# Altium schematic sheet thrust_RP2040.SchDoc
size 381 x 241 mm; SheetNumber: 1; SheetTotal: 1
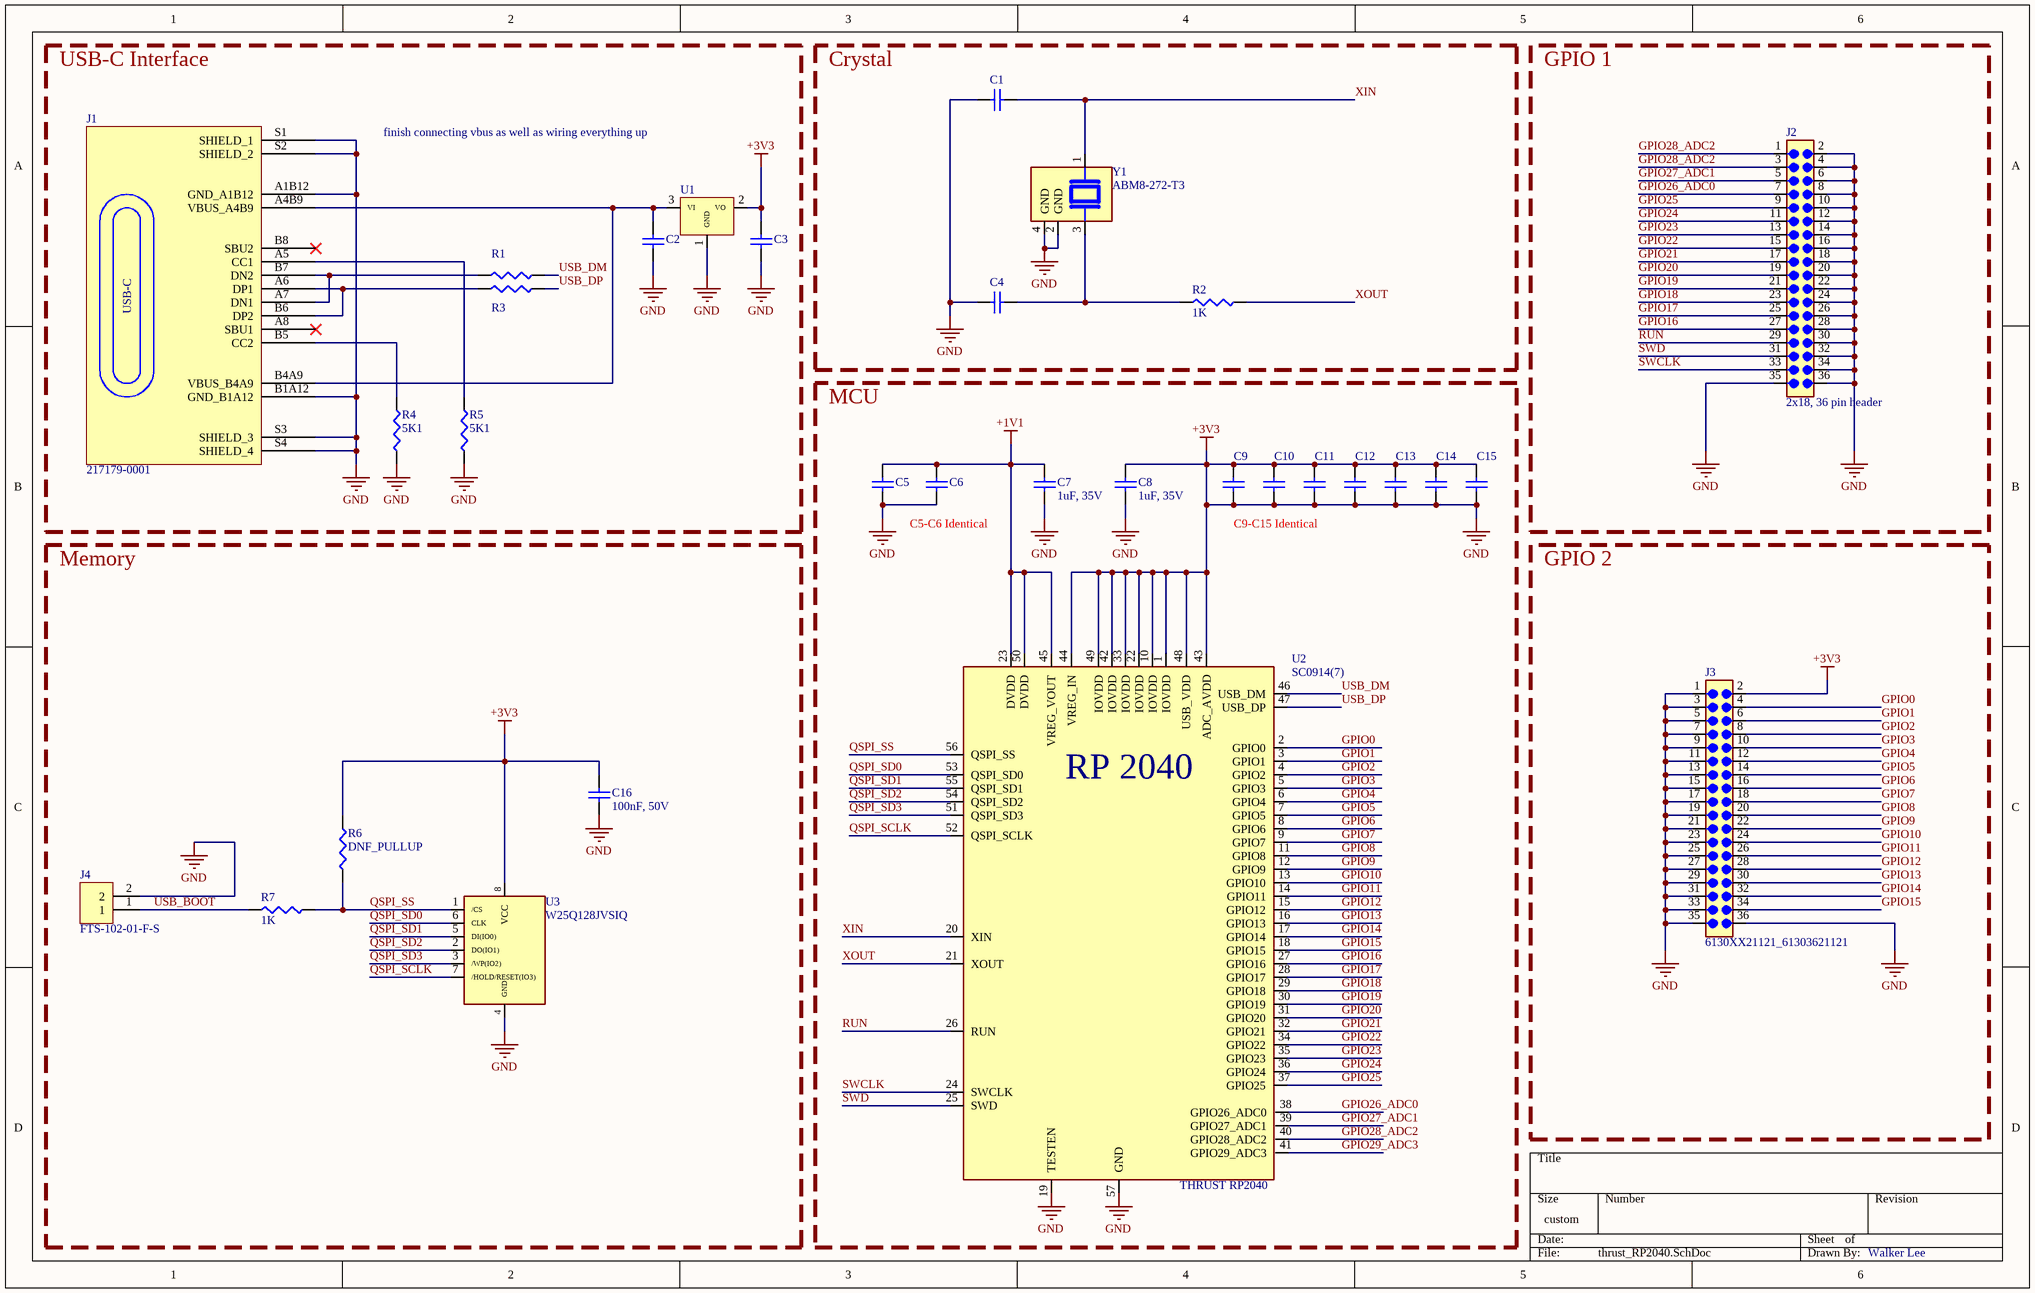
[diagram p0: thrust_RP2040.SchDoc]

## Parts
C1  CL05C150JB5NNNC  (value not drawn)
C2  10uF, 10V  [CAPC1005X55N]  (value not drawn)
C3  10uF, 10V  [CAPC1005X55N]  (value not drawn)
C4  CL05C150JB5NNNC  (value not drawn)
C5  100nF, 50V  [CAPC1005X55N]  (value not drawn)
C6  100nF, 50V  [CAPC1005X55N]  (value not drawn)
C7  1uF, 35V  [CAPC1005X55N]
C8  1uF, 35V  [CAPC1005X55N]
C9  100nF, 50V  [CAPC1005X55N]  (value not drawn)
C10  100nF, 50V  [CAPC1005X55N]  (value not drawn)
C11  100nF, 50V  [CAPC1005X55N]  (value not drawn)
C12  100nF, 50V  [CAPC1005X55N]  (value not drawn)
C13  100nF, 50V  [CAPC1005X55N]  (value not drawn)
C14  100nF, 50V  [CAPC1005X55N]  (value not drawn)
C15  100nF, 50V  [CAPC1005X55N]  (value not drawn)
C16  100nF, 50V  [CAPC1005X55N]
J1  217179-0001  [FP-2171790001-MFG]
J2  2x18, 36 pin header  [61303621121]
J3  6130XX21121_61303621121  [61303621121]
J4  FTS-102-01-F-S
R1  27R  [RESC1005X37N]  (value not drawn)
R2  1K  [RESC1005X37N]
R3  27R  [RESC1005X37N]  (value not drawn)
R4  5K1  [RESC1005X37N]
R5  5K1  [RESC1005X37N]
R6  DNF_PULLUP  [RESC1005X37N]  (no BOM)
R7  1K  [RESC1005X37N]
U1  NCP1117ST33T3G  (value not drawn)
U2  SC0914(7)
U3  W25Q128JVSIQ  [SOIC127P790X216-8N]
Y1  ABM8-272-T3  [XTAL_ABM8-272-T3]

## Blocks framed on the sheet
USB-C Interface: C2 C3 J1 R1 R3-R5 U1
Crystal: C1 C4 R2 Y1
GPIO 1: J2
MCU: C5-C15 U2
Memory: C16 J4 R6 R7 U3
GPIO 2: J3

## Nets
+1V1: C5.2 C6.2 C7.2 U2.23(DVDD) U2.45(VREG_VOUT) U2.50(DVDD)
+3V3: C1.1 C2.1 C3.1 C3.2 C4.1 C5.1 C6.1 C7.1 C8.1 C8.2 C9.1 C9.2 C10.1 C10.2 C11.1 C11.2 C12.1 C12.2 C13.1 C13.2 C14.1 C14.2 C15.1 C15.2 C16.1 C16.2 J1.A1B12(GND_A1B12) J1.B1A12(GND_B1A12) J1.S1(SHIELD_1) J1.S2(SHIELD_2) J1.S3(SHIELD_3) J1.S4(SHIELD_4) J2.2 J2.4 J2.6 J2.8 J2.10 J2.12 J2.14 J2.16 J2.18 J2.20 J2.22 J2.24 J2.26 J2.28 J2.30 J2.32 J2.34 J2.35 J2.36 J3.1 J3.2 J3.3 J3.5 J3.7 J3.9 J3.11 J3.13 J3.15 J3.17 J3.19 J3.21 J3.23 J3.25 J3.27 J3.29 J3.31 J3.33 J3.35 J3.36 J4.2 R4.1 R5.1 R6.2 U1.1(GND) U1.2(VO) U2.1(IOVDD) U2.10(IOVDD) U2.19(TESTEN) U2.22(IOVDD) U2.33(IOVDD) U2.42(IOVDD) U2.43(ADC_AVDD) U2.44(VREG_IN) U2.48(USB_VDD) U2.49(IOVDD) U2.57(GND) U3.4(GND) U3.8(VCC) Y1.2(GND) Y1.4(GND)  [also labelled GND]
~{USB_BOOT}: J4.1 R7.1
GPIO0: J3.4 U2.2(GPIO0)
GPIO1: J3.6 U2.3(GPIO1)
GPIO2: J3.8 U2.4(GPIO2)
GPIO3: J3.10 U2.5(GPIO3)
GPIO4: J3.12 U2.6(GPIO4)
GPIO5: J3.14 U2.7(GPIO5)
GPIO6: J3.16 U2.8(GPIO6)
GPIO7: J3.18 U2.9(GPIO7)
GPIO8: J3.20 U2.11(GPIO8)
GPIO9: J3.22 U2.12(GPIO9)
GPIO10: J3.24 U2.13(GPIO10)
GPIO11: J3.26 U2.14(GPIO11)
GPIO12: J3.28 U2.15(GPIO12)
GPIO13: J3.30 U2.16(GPIO13)
GPIO14: J3.32 U2.17(GPIO14)
GPIO15: J3.34 U2.18(GPIO15)
GPIO16: J2.27 U2.27(GPIO16)
GPIO17: J2.25 U2.28(GPIO17)
GPIO18: J2.23 U2.29(GPIO18)
GPIO19: J2.21 U2.30(GPIO19)
GPIO20: J2.19 U2.31(GPIO20)
GPIO21: J2.17 U2.32(GPIO21)
GPIO22: J2.15 U2.34(GPIO22)
GPIO23: J2.13 U2.35(GPIO23)
GPIO24: J2.11 U2.36(GPIO24)
GPIO25: J2.9 U2.37(GPIO25)
GPIO26_ADC0: J2.7 U2.38(GPIO26_ADC0)
GPIO27_ADC1: J2.5 U2.39(GPIO27_ADC1)
GPIO28_ADC2: J2.1 J2.3 U2.40(GPIO28_ADC2)
GPIO29_ADC3: U2.41(GPIO29_ADC3)
QSPI_SCLK: U2.52(QSPI_SCLK) U3.7(/HOLD/RESET(IO3))
QSPI_SD0: U2.53(QSPI_SD0) U3.6(CLK)
QSPI_SD1: U2.55(QSPI_SD1) U3.5(DI(IO0))
QSPI_SD2: U2.54(QSPI_SD2) U3.2(DO(IO1))
QSPI_SD3: U2.51(QSPI_SD3) U3.3(/WP(IO2))
QSPI_SS: R6.1 R7.2 U2.56(QSPI_SS) U3.1(/CS)
RUN: J2.29 U2.26(RUN)
SWCLK: J2.33 U2.24(SWCLK)
SWD: J2.31 U2.25(SWD)
USB_DM: R1.2 U2.46(USB_DM)
USB_DP: R3.2 U2.47(USB_DP)
XIN: C1.2 U2.20(XIN) Y1.1
XOUT: R2.2 U2.21(XOUT)
NetC2_2: C2.2 J1.A4B9(VBUS_A4B9) J1.B4A9(VBUS_B4A9) U1.3(VI)
NetC4_2: C4.2 R2.1 Y1.3
NetJ1_A5: J1.A5(CC1) R5.2
NetJ1_A6: J1.A6(DP1) J1.B6(DP2) R3.1
NetJ1_A7: J1.A7(DN1) J1.B7(DN2) R1.1
NetJ1_B5: J1.B5(CC2) R4.2

Not connected (* = marked no-connect by the designer): J1 A8(SBU1)* B8(SBU2)*

## Notes on the sheet
- finish connecting vbus as well as wiring everything up
- C5-C6 Identical
- C9-C15 Identical
- (near U2) THRUST RP2040
- Walker Lee
- (in symbol 217179-0001) USB-C
- (in symbol SC0914(7)) RP 2040

## Library data of the parts
C1 C4 = CL05C150JB5NNNC: CAP CER 15PF 50V C0G/NP0 0402; Manufacturer: Samsung Electro-Mechanics; Dielectric: C0G; Dielectric Material: Ceramic; Temperature Coefficient: 30ppm/°C; Tolerance: 5%; Supplier: DigiKey; Supplier Part Number: 1276-1179-6-ND; Manufacturer Part Number: CL05C150JB5NNNC; RoHS: Compliant; Category: Ceramic Capacitors; Stock: 499533; Pricing: 1=0.1, 10=0.027, 50=0.0176, 100=0.015, 500=0.01054, 1000=0.00917, 2500=0.00775, 5000=0.0069 (USD); Value: 15pF; Case/Package: 0402; Case Code (Imperial): 0402; Case Code (Metric): 1005; China RoHS: Compliant; Contact Plating: Tin; Country of Origin: Mainland China, Philippines, South Korea; Depth: 500µm; Export Control Classification Number (ECCN) Code: EAR99; Height: 550µm; Harmonized Tariff Schedule (HTS) Code: 8532.24.00.20; Introduction Date: 2007-11-14; Length: 1mm; Lifecycle Status: Production; Material: Ceramic; Max Operating Temperature: 125°C; Min Operating Temperature: -55°C; Mounting Technology: Surface Mount; Number of Terminals: 2; Radiation Hardening: No; REACH SVHC: Yes; Schedule B: 8532240020, 8532240020|8532240020, 8532240020|8532240020|8532240020, 8532240020|8532240020|8532240020|8532240020; Thickness: 558.8µm; Voltage: 50V; Voltage Rating: 50V; Voltage Rating (DC): 50V; Width: 500µm; ComponentLink1URL: https://datasheet.octopart.com:443/CL05C150JB5NNNC-Samsung-Electro-Mechanics-datasheet-136482249.pdf?src-supplier=IHS; ComponentLink1Description: https://datasheet.octopart.com:443/CL05C150JB5NNNC-Samsung-Electro-Mechanics-datasheet-136482249.pdf?src-supplier=IHS; ComponentLink2URL: https://datasheet.octopart.com:443/CL05C150JB5NNNC-Samsung-Electro-Mechanics-datasheet-11549173.pdf?src-supplier=Future+Electronics; ComponentLink2Description: https://datasheet.octopart.com:443/CL05C150JB5NNNC-Samsung-Electro-Mechanics-datasheet-11549173.pdf?src-supplier=Future+Electronics; ComponentLink3URL: https://datasheet.octopart.com:443/CL05C150JB5NNNC-Samsung-Electro-Mechanics-datasheet-110326796.pdf?src-supplier=Future+Electronics; ComponentLink3Description: https://datasheet.octopart.com:443/CL05C150JB5NNNC-Samsung-Electro-Mechanics-datasheet-110326796.pdf?src-supplier=Future+Electronics; ComponentLink4URL: https://datasheet.octopart.com:443/CL05C150JB5NNNC-Samsung-Electro-Mechanics-datasheet-81461711.pdf?src-supplier=Future+Electronics; ComponentLink4Description: https://datasheet.octopart.com:443/CL05C150JB5NNNC-Samsung-Electro-Mechanics-datasheet-81461711.pdf?src-supplier=Future+Electronics; ComponentLink5URL: https://datasheet.octopart.com:443/CL05C150JB5NNNC-Samsung-datasheet-12555055.pdf?src-supplier=Future+Electronics; ComponentLink5Description: https://datasheet.octopart.com:443/CL05C150JB5NNNC-Samsung-datasheet-12555055.pdf?src-supplier=Future+Electronics; ComponentLink6URL: https://datasheet.octopart.com:443/CL05C150JB5NNNC-Samsung-Electro-Mechanics-datasheet-149136764.pdf?src-supplier=Future+Electronics; ComponentLink6Description: https://datasheet.octopart.com:443/CL05C150JB5NNNC-Samsung-Electro-Mechanics-datasheet-149136764.pdf?src-supplier=Future+Electronics; ComponentLink7URL: https://datasheet.octopart.com:443/CL05C150JB5NNNC-Samsung-datasheet-37081328.pdf?src-supplier=Future+Electronics; ComponentLink7Description: https://datasheet.octopart.com:443/CL05C150JB5NNNC-Samsung-datasheet-37081328.pdf?src-supplier=Future+Electronics; ComponentLink8URL: https://datasheet.octopart.com/CL05C150JB5NNNC-Samsung-Electro-Mechanics-datasheet-97040617.pdf; ComponentLink8Description: https://datasheet.octopart.com/CL05C150JB5NNNC-Samsung-Electro-Mechanics-datasheet-97040617.pdf; ComponentLink9URL: https://datasheet.octopart.com/CL05C150JB5NNNC-Samsung-Electro-Mechanics-datasheet-8324245.pdf; ComponentLink9Description: https://datasheet.octopart.com/CL05C150JB5NNNC-Samsung-Electro-Mechanics-datasheet-8324245.pdf; ComponentLink10URL: https://datasheet.octopart.com:443/CL05C150JB5NNNC-Samsung-datasheet-8326407.pdf?src-supplier=TME; ComponentLink10Description: https://datasheet.octopart.com:443/CL05C150JB5NNNC-Samsung-datasheet-8326407.pdf?src-supplier=TME; LCSC Part Number: C86285
C2 C3 = CL05A106MP8NUB8: CAP CER 10UF 10V X5R 0402; Manufacturer: Samsung; Dielectric Material: Ceramic; Multilayer: Yes; Tolerance  (fill in as +-): 20%; Supplier: Digikey; Supplier Part Number: 1276-6830-1-ND; Manufacturer Part Number: CL05A106MP8NUB8; RoHS: Yes; Category: Ceramic Capacitors; Stock: 1294909; Pricing: 1=0.33, 10=0.215, 50=0.1584, 100=0.129, 500=0.1018, 1000=0.08597, 2500=0.08145 (USD); Mounting Technology: Surface Mount; Pins: 2; Package Shape: Rectangular; Case/Package: 0402; Terminal Finish: Nickel; Min Operating Temperature: -55°C; Max Operating Temperature: 85°C; JESD-609 Code: e3; Value: 10uF; Capacitor Type: Ceramic; Packaging: Tape and Reel; Tolerance (fill in as +-): 20%; Rated DC Voltage (URdc): 10V; Temperature Characteristics Code: X5R; Termination: Wraparound; Reach SVHC Compliant: Yes; RoHS Compliant: Yes; ComponentLink1URL: https://datasheet.ciiva.com:443/pdfs/VipMasterIC/IC/SEMS/SEMS-S-A0008521219/SEMS-S-A0008521325-1.pdf?src-supplier=IHS+Markit; ComponentLink1Description: https://datasheet.ciiva.com:443/pdfs/VipMasterIC/IC/SEMS/SEMS-S-A0008521219/SEMS-S-A0008521325-1.pdf?src-supplier=IHS+Markit; ComponentLink2URL: http://www.samsungsem.com/kr/support/product-search/mlcc/CL05A106MP8NUB8.jsp?src-supplier=Digikey; ComponentLink2Description: http://www.samsungsem.com/kr/support/product-search/mlcc/CL05A106MP8NUB8.jsp?src-supplier=Digikey; ComponentLink3URL: https://datasheet.octopart.com/CL05A106MP8NUB8-Samsung-Electro-Mechanics-datasheet-136460857.pdf?src-supplier=Future+Electronics; ComponentLink3Description: https://datasheet.octopart.com/CL05A106MP8NUB8-Samsung-Electro-Mechanics-datasheet-136460857.pdf?src-supplier=Future+Electronics; LCSC Part Number: C307415
C5 C6 C9-C16 = CL05B104KB54PNC: 50V 100nF X7R 10% 0402 Multilayer Ceramic Capacitors MLCC - SMD/SMT ROHS; Manufacturer: Samsung; Supplier: Digikey; Supplier Part Number: 1276-CL05B104KB54PNCCT-ND; Manufacturer Part Number: CL05B104KB54PNC; RoHS: Yes; Category: Ceramic Capacitors; Stock: 1237875; Pricing: 1=0.1, 10=0.044, 50=0.025, 100=0.0194, 500=0.0146, 1000=0.01147, 2500=0.01043, 5000=0.00959 (USD); Pins: 2; Dielectric Material: Ceramic; Capacitor Type: Ceramic; RoHS Compliant: Yes; Reach SVHC Compliant: Yes; ComponentLink1URL: https://datasheet.ciiva.com:443/pdfs/VipMasterIC/IC/SEMS/SEMS-S-A0006318249/SEMS-S-A0006320959-1.pdf?src-supplier=IHS+Markit; ComponentLink1Description: https://datasheet.ciiva.com:443/pdfs/VipMasterIC/IC/SEMS/SEMS-S-A0006318249/SEMS-S-A0006320959-1.pdf?src-supplier=IHS+Markit; ComponentLink2URL: https://datasheet.octopart.com/CL05B104KB54PNC-Samsung-datasheet-8326407.pdf?src-supplier=TME; ComponentLink2Description: https://datasheet.octopart.com/CL05B104KB54PNC-Samsung-datasheet-8326407.pdf?src-supplier=TME; LCSC Part Number: C307331; Value: 100nF; Case/Package: 0402; China RoHS: Compliant; Country of Origin: Mainland China, Philippines, South Korea; Export Control Classification Number (ECCN) Code: EAR99; Height: 500µm; Harmonized Tariff Schedule (HTS) Code: 8532.24.00.20; Introduction Date: 2018-07-31; Length: 1mm; Lifecycle Status: Production; Material: Ceramic; Max Operating Temperature: 125°C; Min Operating Temperature: -55°C; Mounting Technology: Surface Mount; Number of Terminals: 2; Ratings: AEC-Q200; REACH SVHC: Yes; Schedule B: 8532240020, 8532240020|8532240020|8532240020|8532240020|8532240020|8532240020|8532240020|8532240020|8532240020|8532240020|8532240020|8532240020|8532240020|8532240020|8532240020|8532240020|8532240020|8532240020|8532240020|8532240020|8532240020|8532240020|8532240020|85; Tolerance: 10%; Voltage Rating: 50V; Voltage Rating (DC): 50V; Width: 500µm; ComponentLink3URL: https://datasheet.octopart.com:443/CL05B104KB54PNC-Samsung-Electro-Mechanics-datasheet-182018727.pdf?src-supplier=IHS; ComponentLink3Description: https://datasheet.octopart.com:443/CL05B104KB54PNC-Samsung-Electro-Mechanics-datasheet-182018727.pdf?src-supplier=IHS; ComponentLink4URL: https://datasheet.octopart.com:443/CL05B104KB54PNC-Samsung-Electro-Mechanics-datasheet-138685816.pdf?src-supplier=Samsung+SCT; ComponentLink4Description: https://datasheet.octopart.com:443/CL05B104KB54PNC-Samsung-Electro-Mechanics-datasheet-138685816.pdf?src-supplier=Samsung+SCT; ComponentLink5URL: https://datasheet.octopart.com:443/CL05B104KB54PNC-Samsung-datasheet-8326407.pdf?src-supplier=TME; ComponentLink5Description: https://datasheet.octopart.com:443/CL05B104KB54PNC-Samsung-datasheet-8326407.pdf?src-supplier=TME
C7 C8 = CL05A105KL5NRNC: CAP CER 1UF 35V X5R 0402; Manufacturer: Samsung; Dielectric Material: Ceramic; Multilayer: Yes; Tolerance  (fill in as +-): 10%; Supplier: Digikey; Supplier Part Number: 1276-6796-1-ND; Manufacturer Part Number: CL05A105KL5NRNC; RoHS: Yes; Category: Ceramic Capacitors; Stock: 469958; Pricing: 1=0.33, 10=0.212, 50=0.149, 100=0.1202, 500=0.08934, 1000=0.07818, 2500=0.07446, 5000=0.06887 (USD); Mounting Technology: Surface Mount; Pins: 2; Package Shape: Rectangular; Case/Package: 0402; Terminal Finish: Nickel; Min Operating Temperature: -55°C; Max Operating Temperature: 85°C; JESD-609 Code: e3; Value: 1uF; Capacitor Type: Ceramic; Packaging: Tape and Reel; Tolerance (fill in as +-): 10%; Rated DC Voltage (URdc): 35V; Temperature Characteristics Code: X5R; Termination: Wraparound; Reach SVHC Compliant: Yes; RoHS Compliant: Yes; ComponentLink1URL: https://datasheet.ciiva.com:443/pdfs/VipMasterIC/IC/SEMS/SEMS-S-A0008384515/SEMS-S-A0008872905-1.pdf?src-supplier=IHS+Markit; ComponentLink1Description: https://datasheet.ciiva.com:443/pdfs/VipMasterIC/IC/SEMS/SEMS-S-A0008384515/SEMS-S-A0008872905-1.pdf?src-supplier=IHS+Markit; ComponentLink2URL: http://www.samsungsem.com/kr/support/product-search/mlcc/CL05A105KL5NRNC.jsp?src-supplier=Digikey; ComponentLink2Description: http://www.samsungsem.com/kr/support/product-search/mlcc/CL05A105KL5NRNC.jsp?src-supplier=Digikey; LCSC Part Number: C307413
J1 = 217179-0001: CONN RCP USB2.0 TYP C 24P SMD RA; Manufacturer: Molex; Supplier: Digikey; Supplier Part Number: 900-2171790001CT-ND; Manufacturer Part Number: 217179-0001; RoHS: No; Category: Connectors; Stock: 7228; Pricing: 1=0.9, 10=0.745, 100=0.6212 (USD); LCSC Part Number: C3197684
J2 J3 = 6130XX21121_61303621121: 36 pins, dual Row , straight, gold plating; MF: Wurth Electronics; SnapEDA_Link: https://www.snapeda.com/parts/61303621121/Wurth+Electronics/view-part/?ref=snap; Package: None; Value: *; MP: 61303621121; Check_prices: https://www.snapeda.com/parts/61303621121/Wurth+Electronics/view-part/?ref=eda; DigiKey Part Number: 732-5309-ND
J4 = FTS-102-01-F-S: CONN HEADER VERT 2POS 1.27MM; Manufacturer: Samtec; Manufacturer Series: FTS; Connector Type: BOARD CONNECTOR; Option: General Purpose; Additional Feature: Low Profile; Filter Feature: No; Number of Rows Loaded: 1; Number of Contacts: 2; Supplier: Digikey; Supplier Part Number: SAM15176-ND; Manufacturer Part Number: FTS-102-01-F-S; RoHS: Yes; Category: Connectors; Stock: 1204; Pricing: 1=0.68, 10=0.592, 100=0.4878, 500=0.4242, 1000=0.34996, 5000=0.30754, 10000=0.28634 (USD); Mounting Technology: Board; Contact Material: Bronze; Contact Finish - Mating: GOLD (3) OVER NICKEL (50); Contact Finish - Termination: Matte Tin (Sn) - with Nickel (Ni) barrier; JESD-609 Code: e3; Contact Gender: Male; Mixed Contacts: No; Mounting Style: STRAIGHT; Termination: Solder; Terminal Pitch: 1.27mm; Flammability Rating: UL94 V-0; DIN Conformance: No; IEC Conformance: No; MIL Conformance: No; Reach SVHC Compliant: Yes; RoHS Compliant: Yes; ComponentLink1URL: https://datasheet.ciiva.com:443/pdfs/VipMasterIC/IC/SAMI/SAMI-S-A0001504673/SAMI-S-A0001504673-1.pdf?src-supplier=IHS+Markit; ComponentLink1Description: https://datasheet.ciiva.com:443/pdfs/VipMasterIC/IC/SAMI/SAMI-S-A0001504673/SAMI-S-A0001504673-1.pdf?src-supplier=IHS+Markit; ComponentLink2URL: http://www.samtec.com/documents/webfiles/pdf/FTS.pdf?src-supplier=Avnet; ComponentLink2Description: http://www.samtec.com/documents/webfiles/pdf/FTS.pdf?src-supplier=Avnet; LCSC Part Number: C6045317
R1 R3 = RC0402FR-0727RL: RES 27 OHM 1% 1/16W 0402; Manufacturer: Yageo; Additional Feature: LASER TRIMMABLE; Power: 62.5mW; Rated Temperature: 70°C; Temperature Coefficient: 100ppm/°C; Working Voltage: 50V; Package Height: 0.35mm; Package Length: 1mm; Package Width: 0.5mm; Supplier: Digikey; Supplier Part Number: YAG3086CT-ND; Manufacturer Part Number: RC0402FR-0727RL; RoHS: Yes; Category: Chip SMD Resistors; Stock: 423061; Pricing: 1=0.1, 10=0.015, 50=0.0088, 100=0.0073, 500=0.00488, 1000=0.00417, 5000=0.00297 (USD); Mounting Technology: Surface Mount; Pins: 2; Package Shape: Rectangular; Case/Package: 0402; Terminal Finish: Nickel; Min Operating Temperature: -55°C; Max Operating Temperature: 155°C; Tolerance: 1%; JESD-609 Code: e3; Resistor Type: FIXED RESISTOR; Construction: Chip; Package Style: SMTMeter; Packaging: Tape and Reel; Value: 27R; Technology: METAL GLAZE/THICK FILM; Termination: Wraparound; Reach SVHC Compliant: Yes; RoHS Compliant: Yes; ComponentLink1URL: https://datasheet.ciiva.com:443/pdfs/VipMasterIC/IC/YAGO/YAGO-S-A0008145938/YAGO-S-A0008145938-1.pdf?src-supplier=IHS+Markit; ComponentLink1Description: https://datasheet.ciiva.com:443/pdfs/VipMasterIC/IC/YAGO/YAGO-S-A0008145938/YAGO-S-A0008145938-1.pdf?src-supplier=IHS+Markit; ComponentLink2URL: https://datasheet.ciiva.com/11808/0900766b80c66297-11808450.pdf?src-supplier=Rs; ComponentLink2Description: https://datasheet.ciiva.com/11808/0900766b80c66297-11808450.pdf?src-supplier=Rs; ComponentLink3URL: https://datasheet.ciiva.com/7849/1018594-7849927.pdf?src-supplier=Element14; ComponentLink3Description: https://datasheet.ciiva.com/7849/1018594-7849927.pdf?src-supplier=Element14; ComponentLink4URL: https://datasheet.ciiva.com/7849/1018594-7849926.pdf?src-supplier=Element14; ComponentLink4Description: https://datasheet.ciiva.com/7849/1018594-7849926.pdf?src-supplier=Element14; LCSC Part Number: C138021
R2 R7 = RC0402FR-071KL: RES 1K OHM 1% 1/16W 0402; Manufacturer: Yageo; Additional Feature: LASER TRIMMABLE; Power: 62.5mW; Rated Temperature: 70°C; Value: 1kR; Temperature Coefficient: 100ppm/°C; Working Voltage: 50V; Package Height: 0.35mm; Package Length: 1mm; Package Width: 0.5mm; Supplier: Digikey; Supplier Part Number: 311-1.00KLRCT-ND; Manufacturer Part Number: RC0402FR-071KL; RoHS: Yes; Category: Chip SMD Resistors; Stock: 11967525; Pricing: 1=0.1, 10=0.015, 50=0.0088, 100=0.0073, 500=0.00488, 1000=0.00417, 5000=0.00297 (USD); Mounting Technology: Surface Mount; Pins: 2; Package Shape: Rectangular; Case/Package: 0402; Terminal Finish: Nickel; Min Operating Temperature: -55°C; Max Operating Temperature: 155°C; Tolerance: 1%; JESD-609 Code: e3; Resistor Type: FIXED RESISTOR; Construction: Chip; Package Style: SMTMeter; Packaging: Tape and Reel; Technology: METAL GLAZE/THICK FILM; Termination: Wraparound; Reach SVHC Compliant: Yes; RoHS Compliant: Yes; ComponentLink1URL: https://datasheet.ciiva.com:443/pdfs/VipMasterIC/IC/YAGO/YAGO-S-A0008145938/YAGO-S-A0008145938-1.pdf?src-supplier=IHS+Markit; ComponentLink1Description: https://datasheet.ciiva.com:443/pdfs/VipMasterIC/IC/YAGO/YAGO-S-A0008145938/YAGO-S-A0008145938-1.pdf?src-supplier=IHS+Markit; ComponentLink2URL: https://datasheet.ciiva.com/11819/0900766b80c66297-11819477.pdf?src-supplier=Rs; ComponentLink2Description: https://datasheet.ciiva.com/11819/0900766b80c66297-11819477.pdf?src-supplier=Rs; ComponentLink3URL: https://datasheet.ciiva.com/22747/1018594-22747513.pdf?src-supplier=Element14; ComponentLink3Description: https://datasheet.ciiva.com/22747/1018594-22747513.pdf?src-supplier=Element14; ComponentLink4URL: https://datasheet.ciiva.com/12666/pyu-rc0402-51-rohs-l-6-r-12666741.pdf?src-supplier=Mouser; ComponentLink4Description: https://datasheet.ciiva.com/12666/pyu-rc0402-51-rohs-l-6-r-12666741.pdf?src-supplier=Mouser; ComponentLink5URL: https://datasheet.ciiva.com/17063/pyu-rc0402-51-rohs-l-6-r-17063193.pdf?src-supplier=Future+Electronics; ComponentLink5Description: https://datasheet.ciiva.com/17063/pyu-rc0402-51-rohs-l-6-r-17063193.pdf?src-supplier=Future+Electronics; ComponentLink6URL: https://datasheet.ciiva.com/7983/1018594-7983502.pdf?src-supplier=Element14; ComponentLink6Description: https://datasheet.ciiva.com/7983/1018594-7983502.pdf?src-supplier=Element14; ComponentLink7URL: https://datasheet.ciiva.com/7849/1018594-7849869.pdf?src-supplier=Element14; ComponentLink7Description: https://datasheet.ciiva.com/7849/1018594-7849869.pdf?src-supplier=Element14; ComponentLink8URL: https://datasheet.ciiva.com/7849/1018594-7849871.pdf?src-supplier=Element14; ComponentLink8Description: https://datasheet.ciiva.com/7849/1018594-7849871.pdf?src-supplier=Element14; LCSC Part Number: C106235
R4 R5 = AC0402FR-075K1L: RES SMD 5.1K OHM 1% 1/16W 0402; Manufacturer: Yageo; Additional Feature: LASER TRIMMABLE; Power: 62.5mW; Rated Temperature: 70°C; Value: 5.1kR; Temperature Coefficient: 100ppm/°C; Working Voltage: 50V; Package Height: 0.32mm; Package Length: 1mm; Package Width: 0.5mm; Reference Standard: AEC-Q200; Supplier: Digikey; Supplier Part Number: YAG3503CT-ND; Manufacturer Part Number: AC0402FR-075K1L; RoHS: Yes; Category: Chip SMD Resistors; Stock: 164969; Pricing: 1=0.1, 10=0.019, 50=0.0116, 100=0.0095, 500=0.00638, 1000=0.00544, 5000=0.00391 (USD); Mounting Technology: Surface Mount; Pins: 2; Package Shape: Rectangular; Case/Package: 0402; Terminal Finish: Nickel; Min Operating Temperature: -55°C; Max Operating Temperature: 155°C; Tolerance: 1%; JESD-609 Code: e3; Resistor Type: FIXED RESISTOR; Construction: Chip; Package Style: SMTMeter; Packaging: Tape and Reel; Technology: METAL GLAZE/THICK FILM; Termination: Wraparound; Reach SVHC Compliant: Yes; RoHS Compliant: Yes; ComponentLink1URL: https://datasheet.ciiva.com:443/pdfs/VipMasterIC/IC/YAGO/YAGO-S-A0003597364/YAGO-S-A0003597364-1.pdf?src-supplier=IHS+Markit; ComponentLink1Description: https://datasheet.ciiva.com:443/pdfs/VipMasterIC/IC/YAGO/YAGO-S-A0003597364/YAGO-S-A0003597364-1.pdf?src-supplier=IHS+Markit; ComponentLink2URL: https://datasheet.octopart.com/AC0402FR-075K1L-Yageo-datasheet-166720450.pdf?src-supplier=Future+Electronics; ComponentLink2Description: https://datasheet.octopart.com/AC0402FR-075K1L-Yageo-datasheet-166720450.pdf?src-supplier=Future+Electronics; ComponentLink3URL: http://www.yageo.com/documents/recent/PYu-AC_51_RoHS_L_2_revised.pdf?src-supplier=Future+Electronics; ComponentLink3Description: http://www.yageo.com/documents/recent/PYu-AC_51_RoHS_L_2_revised.pdf?src-supplier=Future+Electronics; LCSC Part Number: C144745
R6 = RC0402FR-071KL_1: Generic 0402 Resistor - DO NOT POPULATE; Manufacturer: Yageo; Tolerance: 1%; Additional Feature: LASER TRIMMABLE; Power: 62.5mW; Rated Temperature: 70°C; Value: 1kR; Temperature Coefficient: 100ppm/°C; Working Voltage: 50V; Package Height: 0.35mm; Package Length: 1mm; Package Width: 0.5mm; Supplier: Digikey; Supplier Part Number: 311-1.00KLRCT-ND; Manufacturer Part Number: RC0402FR-071KL; RoHS: Yes; Category: Chip SMD Resistors; Stock: 11967525; Pricing: 1=0.1, 10=0.015, 50=0.0088, 100=0.0073, 500=0.00488, 1000=0.00417, 5000=0.00297 (USD); Mounting Technology: Surface Mount; Pins: 2; Package Shape: Rectangular; Case/Package: 0402; Terminal Finish: Nickel; Min Operating Temperature: -55°C; Max Operating Temperature: 155°C; JESD-609 Code: e3; Resistor Type: FIXED RESISTOR; Construction: Chip; Package Style: SMTMeter; Packaging: Tape and Reel; Technology: METAL GLAZE/THICK FILM; Termination: Wraparound; Reach SVHC Compliant: Yes; RoHS Compliant: Yes; LCSC Part Number: C106235
U1 = NCP1117ST33T3G: IC REG LINEAR 3.3V 1A SOT-223; Manufacturer: onsemi; Manufacturer Lifecycle Status: ACTIVE; Accuracy: 1%; Input Bias Current: 6mA; Max Supply Voltage: 15V; Max Junction Temperature (Tj): 150°C; Min Input Voltage: 4.75V; Number of Channels: 1; Output Type: Fixed; Polarity: Positive; Power Rating: 100mW; Quiescent Current: 10mA; Reference Voltage: 1.25V; Value: 220kΩ; Voltage Rating: 75V; Voltage Tolerance: 2%; Supplier: DigiKey; Supplier Part Number: NCP1117ST33T3GOSCT-ND; Manufacturer Part Number: NCP1117ST33T3G; RoHS: Compliant; Category: LDO Voltage Regulators; Stock: 50575; Pricing: 1=0.6, 10=0.42, 25=0.376, 100=0.3278, 250=0.30472, 500=0.29084, 1000=0.27939, 4000=0.25458, 8000=0.24839 (USD); Case/Package: SOP; Case Code (Imperial): 0603; Case Code (Metric): 1608; China RoHS: Compliant; Contact Plating: Tin; Halogen Free: Halogen Free; Height: 450µm; Height - Seated (Max): 1.8mm; Lead Free: Lead Free; Length: 6.5mm; Lifecycle Status: Production; Max Operating Temperature: 125°C; Max Output current: 1A; Max Output Voltage: 3.3V; Min Current Limit: 1A; Min Operating Temperature: 0°C; Min Output Voltage: 3.3V; Min Supply Voltage: 4.75V; Mounting Technology: Surface Mount; Nominal Output Voltage: 3.3V; Number of Circuits: 1; Number of Outputs: 1; Pins: 4; Number of Regulators: 1; Number of Terminals: 4; Output Current: 1A; Output Voltage: 3.3V; Output Voltage Accuracy: 1%; Packaging: Tape and Reel; Radiation Hardening: No; Ratings: AEC-Q100; REACH SVHC: Yes; Schedule B: 8542390000, 8542390000|8542390000|8542390000|8542390000|8542390000|8542390000|8542390000|8542390000|8542390000|8542390000|8542390000|8542390000|8542390000|8542390000|8542390000|8542390000|8542390000|8542390000|8542390000|8542390000|8542390000|8542390000|8542390000|85; Terminal Pitch: 2.3mm; Termination: SMD/SMT; Tolerance: 1%; Weight: 2.012816mg; Width: 3.5mm; ComponentLink1URL: https://datasheet.octopart.com:443/NCP1117ST33T3G-ON-Semiconductor-datasheet-11536806.pdf?src-supplier=Newark; ComponentLink1Description: https://datasheet.octopart.com:443/NCP1117ST33T3G-ON-Semiconductor-datasheet-11536806.pdf?src-supplier=Newark; ComponentLink2URL: https://datasheet.octopart.com:443/NCP1117ST33T3G-ON-Semiconductor-datasheet-8478322.pdf?src-supplier=Newark; ComponentLink2Description: https://datasheet.octopart.com:443/NCP1117ST33T3G-ON-Semiconductor-datasheet-8478322.pdf?src-supplier=Newark; ComponentLink3URL: https://datasheet.octopart.com:443/NCP1117ST33T3G-ON-Semiconductor-datasheet-5326951.pdf?src-supplier=Newark; ComponentLink3Description: https://datasheet.octopart.com:443/NCP1117ST33T3G-ON-Semiconductor-datasheet-5326951.pdf?src-supplier=Newark; ComponentLink4URL: https://datasheet.octopart.com:443/NCP1117ST33T3G-ON-Semiconductor-datasheet-78758821.pdf?src-supplier=Newark; ComponentLink4Description: https://datasheet.octopart.com:443/NCP1117ST33T3G-ON-Semiconductor-datasheet-78758821.pdf?src-supplier=Newark; ComponentLink5URL: https://datasheet.octopart.com:443/NCP1117ST33T3G-onsemi-datasheet-180965004.pdf?src-supplier=IHS; ComponentLink5Description: https://datasheet.octopart.com:443/NCP1117ST33T3G-onsemi-datasheet-180965004.pdf?src-supplier=IHS; ComponentLink6URL: https://datasheet.octopart.com:443/NCP1117ST33T3G-ON-Semiconductor-datasheet-138897322.pdf?src-supplier=Augswan; ComponentLink6Description: https://datasheet.octopart.com:443/NCP1117ST33T3G-ON-Semiconductor-datasheet-138897322.pdf?src-supplier=Augswan; ComponentLink7URL: https://datasheet.octopart.com:443/NCP1117ST33T3G-ON-Semiconductor-datasheet-20694859.pdf?src-supplier=Farnell; ComponentLink7Description: https://datasheet.octopart.com:443/NCP1117ST33T3G-ON-Semiconductor-datasheet-20694859.pdf?src-supplier=Farnell; ComponentLink8URL: https://datasheet.octopart.com:443/NCP1117ST33T3G-ON-Semiconductor-datasheet-16809071.pdf?src-supplier=Farnell; ComponentLink8Description: https://datasheet.octopart.com:443/NCP1117ST33T3G-ON-Semiconductor-datasheet-16809071.pdf?src-supplier=Farnell; ComponentLink9URL: https://datasheet.octopart.com:443/NCP1117ST33T3G-ON-Semiconductor-datasheet-5330140.pdf?src-supplier=Farnell; ComponentLink9Description: https://datasheet.octopart.com:443/NCP1117ST33T3G-ON-Semiconductor-datasheet-5330140.pdf?src-supplier=Farnell; ComponentLink10URL: https://datasheet.octopart.com:443/NCP1117ST33T3G-ON-Semiconductor-datasheet-7627526.pdf?src-supplier=Farnell; ComponentLink10Description: https://datasheet.octopart.com:443/NCP1117ST33T3G-ON-Semiconductor-datasheet-7627526.pdf?src-supplier=Farnell; ComponentLink11URL: https://datasheet.octopart.com:443/NCP1117ST33T3G-onsemi-datasheet-157855866.pdf?src-supplier=TME; ComponentLink11Description: https://datasheet.octopart.com:443/NCP1117ST33T3G-onsemi-datasheet-157855866.pdf?src-supplier=TME; ComponentLink12URL: https://datasheet.octopart.com:443/NCP1117ST33T3G-ON-Semiconductor-datasheet-38720738.pdf?src-supplier=RS+(Formerly+Allied+Electronics); ComponentLink12Description: https://datasheet.octopart.com:443/NCP1117ST33T3G-ON-Semiconductor-datasheet-38720738.pdf?src-supplier=RS+(Formerly+Allied+Electronics); ComponentLink13URL: https://datasheet.octopart.com:443/NCP1117ST33T3G-ON-Semiconductor-datasheet-14168854.pdf?src-supplier=iiiC; ComponentLink13Description: https://datasheet.octopart.com:443/NCP1117ST33T3G-ON-Semiconductor-datasheet-14168854.pdf?src-supplier=iiiC; ComponentLink14URL: http://sigma.octopart.com:80/15540786/rohs_certificate/ON-Semiconductor-NCP1117ST33T3G.pdf?src-supplier=Compliance+Statements; ComponentLink14Description: http://sigma.octopart.com:80/15540786/rohs_certificate/ON-Semiconductor-NCP1117ST33T3G.pdf?src-supplier=Compliance+Statements; ComponentLink15URL: http://sigma.octopart.com:80/15681617/materials_sheet/ON-Semiconductor-NCP1117ST33T3G.csv?src-supplier=Compliance+Statements; ComponentLink15Description: http://sigma.octopart.com:80/15681617/materials_sheet/ON-Semiconductor-NCP1117ST33T3G.csv?src-supplier=Compliance+Statements; ComponentLink16URL: http://sigma.octopart.com:80/150621358/rohs_statement/ON-Semiconductor-NCP1117ST33T3G.pdf?src-supplier=Compliance+Statements; ComponentLink16Description: http://sigma.octopart.com:80/150621358/rohs_statement/ON-Semiconductor-NCP1117ST33T3G.pdf?src-supplier=Compliance+Statements; ComponentLink17URL: http://sigma.octopart.com:80/reach_statement/ON-Semiconductor-company-79.pdf?src-supplier=Compliance+Statements; ComponentLink17Description: http://sigma.octopart.com:80/reach_statement/ON-Semiconductor-company-79.pdf?src-supplier=Compliance+Statements; ComponentLink18URL: https://octopart.com:443/opatz8j6/c1?t=KHgUqof7E816k_dQATpolSqw3NCmPU_iyICzlXAUIjl7RUiQXsFAQoTdGccYUsFp9rrolQX2qUcg4AVgIw5FPNukDpn7umAKBdRJ3jioYq70Xpuh1BstpBEj8jqgjBbJ2LourZVrsbR2qGSNZgpFDdapECFNR1zCU02ohquAxny97BVRXa0f-zPMYkr2XC2jXlqOmeOu_IEz5KEYLDD_f5QkUFPh_fvcf5FG13bzi1LJhYYyMCkFQEwttEPV1dQcSJ8dmZmnWRGNKgsjk43CkZiUjyXrxzaOaCPAYLMe_7B9yb0rX0LMO1IZJj36RmMeyXAyxdLs2vyO7x4Xe754WjIynJD9dIOGmc2foa-_H98&src-supplier=Compliance+Statements; ComponentLink18Description: https://octopart.com:443/opatz8j6/c1?t=KHgUqof7E816k_dQATpolSqw3NCmPU_iyICzlXAUIjl7RUiQXsFAQoTdGccYUsFp9rrolQX2qUcg4AVgIw5FPNukDpn7umAKBdRJ3jioYq70Xpuh1BstpBEj8jqgjBbJ2LourZVrsbR2qGSNZgpFDdapECFNR1zCU02ohquAxny97BVRXa0f-zPMYkr2XC2jXlqOmeOu_IEz5KEYLDD_f5QkUFPh_fvcf5FG13bzi1LJhYYyMCkFQEwttEPV1dQcSJ8dmZmnWRGNKgsjk43CkZiUjyXrxzaOaCPAYLMe_7B9yb0rX0LMO1IZJj36RmMeyXAyxdLs2vyO7x4Xe754WjIynJD9dIOGmc2foa-_H98&src-supplier=Compliance+Statements; ComponentLink19URL: https://octopart.com:443/opatz8j6/c1?t=pMrzQ365t0pcR7ooXi4zoo6Akmp0TVp2VnZuf957Qn2lwbrmCdLipgxFv4YraZSR83R2K36wUmyt2XVFOcX8YjGMK6LApWIuARGX9hYeFeM_D34gf-lDQdRtTOi7fDqA1pSbUwF7vXPfQDNQJR2Z6GNg0X_tgABVK7sgXKYZYbC_XSU4OovoMoiRB8KrxZXhdwg8lBX_FOfcFltOmX8eOzaBMFjs8tQfZoGiMZgUiH0IIEbXGhxSzWQTM-UML9RGYQ5sMAjdnXza_jlFPtTbUZBC4-2kpIgWhKPqcway_cB7wIaqnKG9xeisz2VRQjI_gSzyhLLoiIRB2ouI2PIPm558FaUy3nJUWzlHcAzgbA&src-supplier=Compliance+Statements; ComponentLink19Description: https://octopart.com:443/opatz8j6/c1?t=pMrzQ365t0pcR7ooXi4zoo6Akmp0TVp2VnZuf957Qn2lwbrmCdLipgxFv4YraZSR83R2K36wUmyt2XVFOcX8YjGMK6LApWIuARGX9hYeFeM_D34gf-lDQdRtTOi7fDqA1pSbUwF7vXPfQDNQJR2Z6GNg0X_tgABVK7sgXKYZYbC_XSU4OovoMoiRB8KrxZXhdwg8lBX_FOfcFltOmX8eOzaBMFjs8tQfZoGiMZgUiH0IIEbXGhxSzWQTM-UML9RGYQ5sMAjdnXza_jlFPtTbUZBC4-2kpIgWhKPqcway_cB7wIaqnKG9xeisz2VRQjI_gSzyhLLoiIRB2ouI2PIPm558FaUy3nJUWzlHcAzgbA&src-supplier=Compliance+Statements; LCSC Part Number: C26537
U2 = SC0914(7): RISC Microcontroller, FLASH, Cortex-M0+ CPU, 133MHz, CMOS; Manufacturer: Raspberry Pi; ADC Channels (Resolution): 4-Ch 12-Bit; Interface: QSPI, USB; Clock Frequency: 15MHz; Max Supply Current: 14.7mA; Max Supply Voltage: 1.16V; Min Supply Voltage: 1.05V; Number of I/Os: 4; Number of Interrupts: 26; Number of Timers/Counters: 5; Operating Supply Voltage: 1.1V; Peripherals: POR, WDT; RAM Size: 264kB; Supplier: DigiKey; Supplier Part Number: 2648-SC0914(7)CT-ND; Manufacturer Part Number: SC0914(7); RoHS: Compliant; Category: Microcontrollers; Stock: 15229; Pricing: 1=0.92, 500=0.8 (USD); Height - Seated (Max): 900µm; Harmonized Tariff Schedule (HTS) Code: 8542.31.00.30; Length: 7mm; Max Operating Temperature: 85°C; Memory Format: FLASH; Min Operating Temperature: -40°C; Number of Terminals: 56; Terminal Pitch: 400µm; Width: 7mm; ComponentLink1URL: https://datasheet.octopart.com:443/SC0914%287%29-Raspberry-Pi-datasheet-181182706.pdf?src-supplier=IHS; ComponentLink1Description: https://datasheet.octopart.com:443/SC0914%287%29-Raspberry-Pi-datasheet-181182706.pdf?src-supplier=IHS; LCSC Part Number: C6472266
U3 = W25Q128JVSIQ: FLASH - NOR Memory IC 128Mb (16M x 8) SPI - Quad I/O, QPI, DTR 133 MHz 8-SOIC; MF: Winbond Electronics; SnapEDA_Link: https://www.snapeda.com/parts/W25Q128JVSIQ/Winbond/view-part/?ref=snap; Package: SOIC-8 Winbond Electronics; Value: *; MP: W25Q128JVSIQ; Check_prices: https://www.snapeda.com/parts/W25Q128JVSIQ/Winbond/view-part/?ref=eda; LCSC Part Number: C97521
Y1 = ABM8-272-T3: 12 MHz Â±30ppm Crystal 10pF 50 Ohms 4-SMD, No Lead; MF: ABRACON; SnapEDA_Link: https://www.snapeda.com/parts/ABM8-272-T3/Abracon/view-part/?ref=snap; Package: NON-STANDARD-4 Abracon; Value: *; MP: ABM8-272-T3; Check_prices: https://www.snapeda.com/parts/ABM8-272-T3/Abracon/view-part/?ref=eda; LCSC Part Number: C20625731